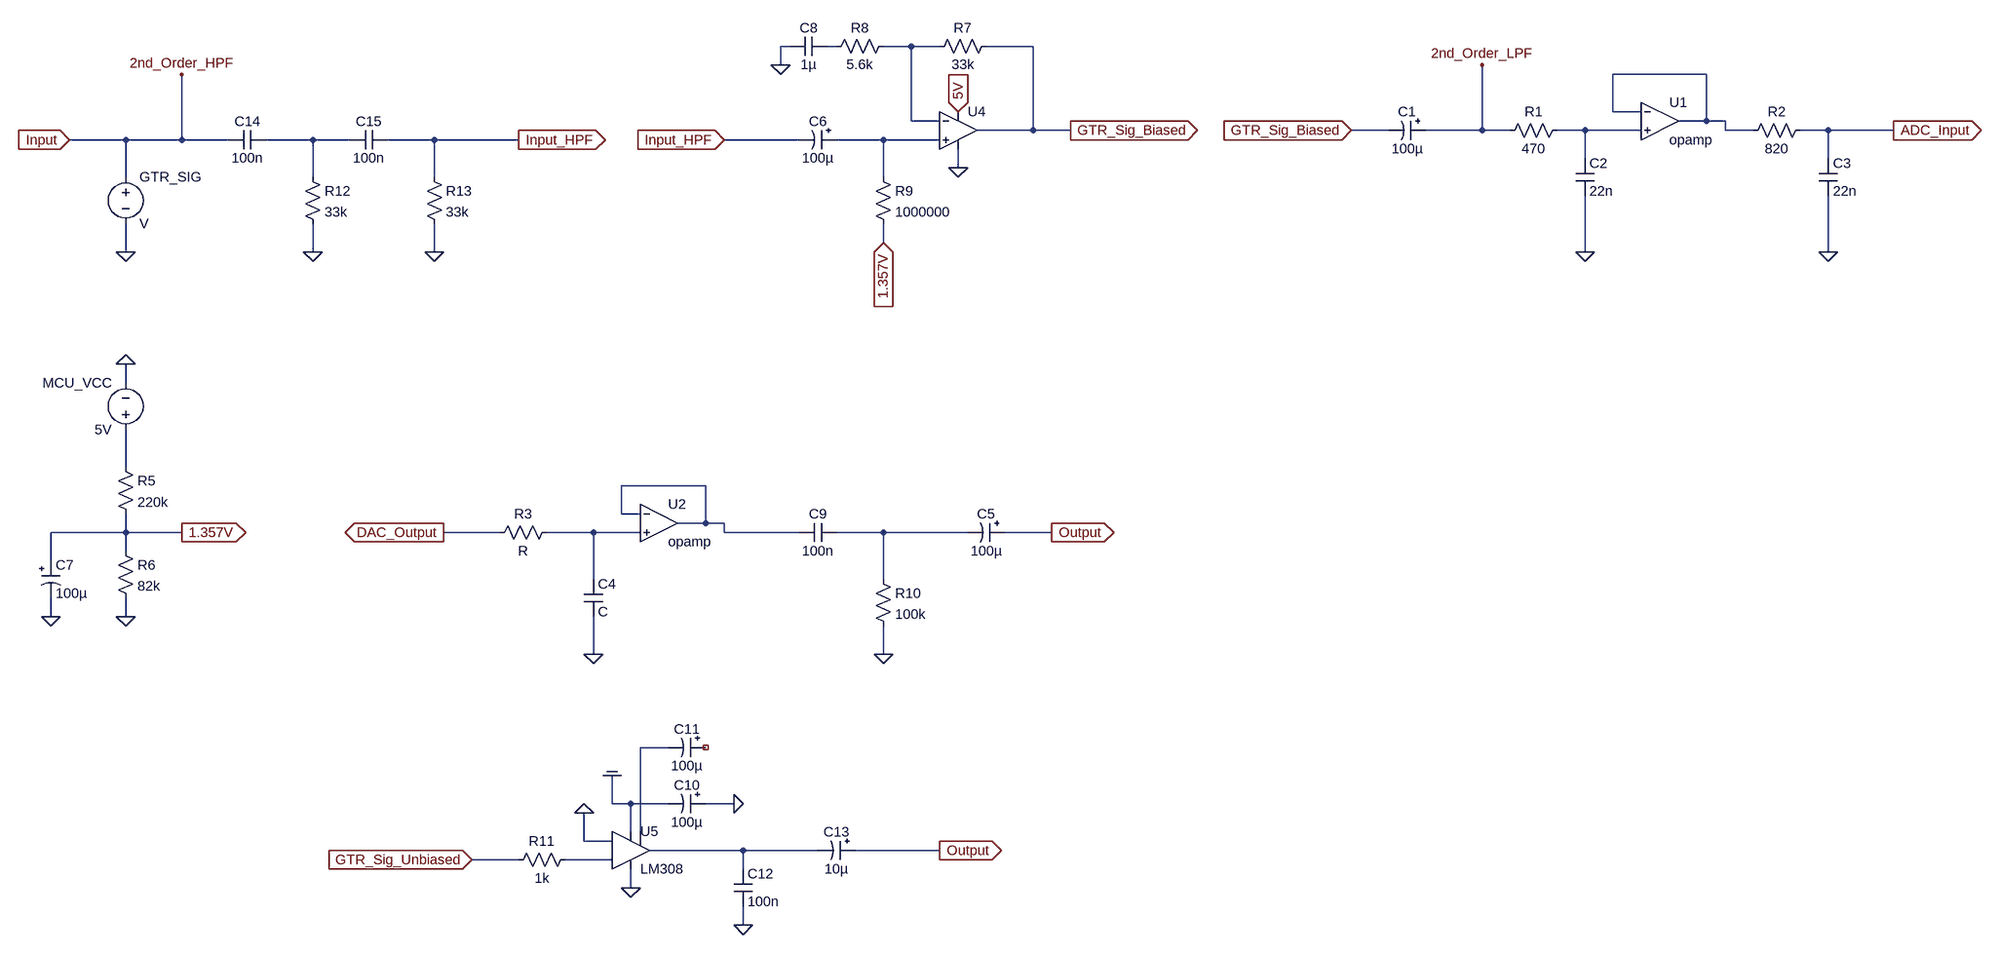
[diagram p0: schematic DigitalGuitarPedal.asc]
DigitalGuitarPedal.asc, the LTspice schematic file:
Version 4
SHEET 1 2988 1252
WIRE -240 -272 -256 -272
WIRE -160 -272 -176 -272
WIRE -32 -272 -80 -272
WIRE 16 -272 -32 -272
WIRE 176 -272 96 -272
WIRE -256 -240 -256 -272
WIRE 1328 -224 1168 -224
WIRE 1168 -160 1168 -224
WIRE 1216 -160 1168 -160
WIRE -32 -144 -32 -272
WIRE 16 -144 -32 -144
WIRE 1328 -144 1328 -224
WIRE 1328 -144 1280 -144
WIRE 1360 -144 1328 -144
WIRE 176 -128 176 -272
WIRE 176 -128 80 -128
WIRE 240 -128 176 -128
WIRE 784 -128 720 -128
WIRE 944 -128 944 -240
WIRE 944 -128 848 -128
WIRE 992 -128 944 -128
WIRE 1120 -128 1072 -128
WIRE 1216 -128 1120 -128
WIRE 1360 -128 1360 -144
WIRE 1408 -128 1360 -128
WIRE 1536 -128 1488 -128
WIRE 1648 -128 1536 -128
WIRE -1376 -112 -1472 -112
WIRE -1280 -112 -1280 -224
WIRE -1280 -112 -1376 -112
WIRE -1200 -112 -1280 -112
WIRE -1056 -112 -1136 -112
WIRE -992 -112 -1056 -112
WIRE -848 -112 -928 -112
WIRE -704 -112 -848 -112
WIRE -224 -112 -352 -112
WIRE -80 -112 -160 -112
WIRE 16 -112 -80 -112
WIRE 1120 -80 1120 -128
WIRE 1536 -80 1536 -128
WIRE 48 -64 48 -96
WIRE -1376 -48 -1376 -112
WIRE -1056 -48 -1056 -112
WIRE -848 -48 -848 -112
WIRE -80 -48 -80 -112
WIRE -80 64 -80 32
WIRE -1376 80 -1376 32
WIRE -1056 80 -1056 32
WIRE -848 80 -848 32
WIRE 1120 80 1120 -16
WIRE 1536 80 1536 -16
WIRE -1376 304 -1376 272
WIRE -1376 448 -1376 384
WIRE -384 480 -528 480
WIRE -528 528 -528 480
WIRE -496 528 -528 528
WIRE -384 544 -384 480
WIRE -384 544 -432 544
WIRE -352 544 -384 544
WIRE -1376 560 -1376 528
WIRE -1376 560 -1504 560
WIRE -1280 560 -1376 560
WIRE -736 560 -832 560
WIRE -576 560 -656 560
WIRE -496 560 -576 560
WIRE -352 560 -352 544
WIRE -224 560 -352 560
WIRE -80 560 -160 560
WIRE 64 560 -80 560
WIRE 208 560 128 560
WIRE -1376 592 -1376 560
WIRE -1504 608 -1504 560
WIRE -576 640 -576 560
WIRE -80 640 -80 560
WIRE -1504 704 -1504 672
WIRE -1376 704 -1376 672
WIRE -576 768 -576 704
WIRE -80 768 -80 720
WIRE -448 928 -496 928
WIRE -544 1024 -544 976
WIRE -512 1024 -544 1024
WIRE -448 1024 -512 1024
WIRE -336 1024 -384 1024
WIRE -512 1072 -512 1024
WIRE -496 1072 -496 928
WIRE -592 1088 -592 1040
WIRE -544 1088 -592 1088
WIRE -320 1104 -480 1104
WIRE -192 1104 -320 1104
WIRE 16 1104 -128 1104
WIRE -704 1120 -784 1120
WIRE -544 1120 -624 1120
WIRE -320 1136 -320 1104
WIRE -512 1168 -512 1136
WIRE -320 1232 -320 1200
FLAG -1376 80 0
FLAG 720 -128 GTR_Sig_Biased
IOPIN 720 -128 In
FLAG 1120 80 0
FLAG 1536 80 0
FLAG 944 -240 2nd_Order_LPF
FLAG -1280 -224 2nd_Order_HPF
FLAG -352 -112 Input_HPF
IOPIN -352 -112 In
FLAG -1376 272 0
FLAG -1504 704 0
FLAG -1376 704 0
FLAG -1280 560 1.357V
IOPIN -1280 560 Out
FLAG 48 -64 0
FLAG -256 -240 0
FLAG 48 -160 5V
IOPIN 48 -160 In
FLAG -80 64 1.357V
IOPIN -80 64 In
FLAG 240 -128 GTR_Sig_Biased
IOPIN 240 -128 Out
FLAG -832 560 DAC_Output
IOPIN -832 560 Out
FLAG -80 768 0
FLAG -784 1120 GTR_Sig_Unbiased
IOPIN -784 1120 In
FLAG -592 1040 0
FLAG -512 1168 0
FLAG -544 976 COM
FLAG -336 1024 0
FLAG -320 1232 0
FLAG 16 1104 Output
IOPIN 16 1104 Out
FLAG -1472 -112 Input
IOPIN -1472 -112 In
FLAG -848 80 0
FLAG -1056 80 0
FLAG -704 -112 Input_HPF
IOPIN -704 -112 Out
FLAG 1648 -128 ADC_Input
IOPIN 1648 -128 Out
FLAG -576 768 0
FLAG 208 560 Output
IOPIN 208 560 Out
SYMBOL voltage -1376 -64 R0
SYMATTR InstName GTR_SIG
SYMBOL polcap 848 -144 R90
WINDOW 0 0 32 VBottom 2
WINDOW 3 32 32 VTop 2
SYMATTR InstName C1
SYMATTR Value 100µ
SYMATTR Description Capacitor
SYMATTR Type cap
SYMATTR SpiceLine V=35 Irms=1.95 Rser=0.03 Lser=0
SYMBOL res 1088 -144 R90
WINDOW 0 0 56 VBottom 2
WINDOW 3 32 56 VTop 2
SYMATTR InstName R1
SYMATTR Value 470
SYMBOL cap 1104 -80 R0
SYMATTR InstName C2
SYMATTR Value 22n
SYMBOL OpAmps\\opamp 1248 -208 R0
SYMATTR InstName U1
SYMBOL res 1504 -144 R90
WINDOW 0 0 56 VBottom 2
WINDOW 3 32 56 VTop 2
SYMATTR InstName R2
SYMATTR Value 820
SYMBOL cap 1520 -80 R0
SYMATTR InstName C3
SYMATTR Value 22n
SYMBOL polcap -160 -128 R90
WINDOW 0 0 32 VBottom 2
WINDOW 3 32 32 VTop 2
SYMATTR InstName C6
SYMATTR Value 100µ
SYMATTR Description Capacitor
SYMATTR Type cap
SYMATTR SpiceLine V=35 Irms=1.95 Rser=0.03 Lser=0
SYMBOL voltage -1376 400 R180
WINDOW 0 24 96 Left 2
WINDOW 3 24 16 Left 2
WINDOW 123 0 0 Left 0
WINDOW 39 0 0 Left 0
SYMATTR InstName MCU_VCC
SYMATTR Value 5V
SYMBOL res -1392 432 R0
SYMATTR InstName R5
SYMATTR Value 220k
SYMBOL res -1392 576 R0
SYMATTR InstName R6
SYMATTR Value 82k
SYMBOL polcap -1520 608 R0
WINDOW 3 24 56 Left 2
SYMATTR InstName C7
SYMATTR Value 100µ
SYMATTR Description Capacitor
SYMATTR Type cap
SYMATTR SpiceLine V=10 Irms=1.04 Rser=0.062 Lser=0
SYMBOL OpAmps\\UniversalOpAmp 48 -128 R0
SYMATTR InstName U4
SYMBOL res 112 -288 R90
WINDOW 0 0 56 VBottom 2
WINDOW 3 32 56 VTop 2
SYMATTR InstName R7
SYMATTR Value 33k
SYMBOL res -64 -288 R90
WINDOW 0 0 56 VBottom 2
WINDOW 3 32 56 VTop 2
SYMATTR InstName R8
SYMATTR Value 5.6k
SYMBOL cap -176 -288 R90
WINDOW 0 0 32 VBottom 2
WINDOW 3 32 32 VTop 2
SYMATTR InstName C8
SYMATTR Value 1µ
SYMBOL res -96 -64 R0
SYMATTR InstName R9
SYMATTR Value 1000000
SYMBOL cap -160 544 R90
WINDOW 0 0 32 VBottom 2
WINDOW 3 32 32 VTop 2
SYMATTR InstName C9
SYMATTR Value 100n
SYMBOL res -96 624 R0
SYMATTR InstName R10
SYMATTR Value 100k
SYMBOL OpAmps\\LM308 -512 1040 R0
SYMATTR InstName U5
SYMBOL res -608 1104 R90
WINDOW 0 0 56 VBottom 2
WINDOW 3 32 56 VTop 2
SYMATTR InstName R11
SYMATTR Value 1k
SYMBOL polcap -384 1008 R90
WINDOW 0 0 32 VBottom 2
WINDOW 3 32 32 VTop 2
SYMATTR InstName C10
SYMATTR Value 100µ
SYMATTR Description Capacitor
SYMATTR Type cap
SYMATTR SpiceLine V=6.3 Irms=4.08248 Rser=0.015 Lser=0 mfg="KEMET" pn="A700D107M006ATE015" type="Al electrolytic"
SYMBOL polcap -384 912 R90
WINDOW 0 0 32 VBottom 2
WINDOW 3 32 32 VTop 2
SYMATTR InstName C11
SYMATTR Value 100µ
SYMATTR Description Capacitor
SYMATTR Type cap
SYMATTR SpiceLine V=6.3 Irms=4.08248 Rser=0.015 Lser=0 mfg="KEMET" pn="A700D107M006ATE015" type="Al electrolytic"
SYMBOL cap -336 1136 R0
SYMATTR InstName C12
SYMATTR Value 100n
SYMBOL polcap -128 1088 R90
WINDOW 0 0 32 VBottom 2
WINDOW 3 32 32 VTop 2
SYMATTR InstName C13
SYMATTR Value 10µ
SYMATTR Description Capacitor
SYMATTR Type cap
SYMATTR SpiceLine V=10 Irms=1.04 Rser=0.062 Lser=0
SYMBOL cap -1136 -128 R90
WINDOW 0 0 32 VBottom 2
WINDOW 3 32 32 VTop 2
SYMATTR InstName C14
SYMATTR Value 100n
SYMBOL cap -928 -128 R90
WINDOW 0 0 32 VBottom 2
WINDOW 3 32 32 VTop 2
SYMATTR InstName C15
SYMATTR Value 100n
SYMBOL res -1072 -64 R0
SYMATTR InstName R12
SYMATTR Value 33k
SYMBOL res -864 -64 R0
SYMATTR InstName R13
SYMATTR Value 33k
SYMBOL cap -592 640 R0
SYMATTR InstName C4
SYMBOL res -640 544 R90
WINDOW 0 0 56 VBottom 2
WINDOW 3 32 56 VTop 2
SYMATTR InstName R3
SYMBOL OpAmps\\opamp -464 480 R0
SYMATTR InstName U2
SYMBOL polcap 128 544 R90
WINDOW 0 0 32 VBottom 2
WINDOW 3 32 32 VTop 2
SYMATTR InstName C5
SYMATTR Value 100µ
SYMATTR Description Capacitor
SYMATTR Type cap
SYMATTR SpiceLine V=10 Irms=1.04 Rser=0.062 Lser=0

The netlist it stands for:
* DigitalGuitarPedal.asc
V§GTR_SIG Input 0 V
C1 2nd_Order_LPF GTR_Sig_Biased 100µ V=35 Irms=1.95 Rser=0.03 Lser=0
R1 N004 2nd_Order_LPF 470
C2 N004 0 22n
XU1 N003 N004 N003 opamp Aol=100K GBW=10Meg  ; pins invin noninvin out
R2 ADC_Input N003 820
C3 ADC_Input 0 22n
C6 N006 Input_HPF 100µ V=35 Irms=1.95 Rser=0.03 Lser=0
V§MCU_VCC N007 0 5V
R5 N007 1.357V 220k
R6 1.357V 0 82k
C7 1.357V 0 100µ V=10 Irms=1.04 Rser=0.062 Lser=0
XU4 N006 N002 5V 0 GTR_Sig_Biased level1 Avol=1Meg GBW=10Meg Vos=0 En=0 Enk=0 In=0 Ink=0 Rin=500Meg  ; pins In+ In- V+ V- OUT
R7 GTR_Sig_Biased N002 33k
R8 N002 N001 5.6k
C8 N001 0 1µ
R9 N006 1.357V 1000000
C9 N010 N008 100n
R10 N010 0 100k
XU5 N013 0 N011 0 N012 NC_01 COM LT1008
R11 N013 GTR_Sig_Unbiased 1k
C10 0 COM 100µ V=6.3 Irms=4.08248 Rser=0.015 Lser=0 mfg="KEMET" pn="A700D107M006ATE015" type="Al electrolytic"
C11 NC_02 N011 100µ V=6.3 Irms=4.08248 Rser=0.015 Lser=0 mfg="KEMET" pn="A700D107M006ATE015" type="Al electrolytic"
C12 N012 0 100n
C13 Output N012 10µ V=10 Irms=1.04 Rser=0.062 Lser=0
C14 N005 Input 100n
C15 Input_HPF N005 100n
R12 N005 0 33k
R13 Input_HPF 0 33k
C4 N009 0 C
R3 N009 DAC_Output R
XU2 N008 N009 N008 opamp Aol=100K GBW=10Meg  ; pins invin noninvin out
C5 Output N010 100µ V=10 Irms=1.04 Rser=0.062 Lser=0
.lib UniversalOpAmp1.lib
.lib LTC.lib
.backanno
.end